# EAGLE design qwiic_blower (EAGLE 9.5.2)
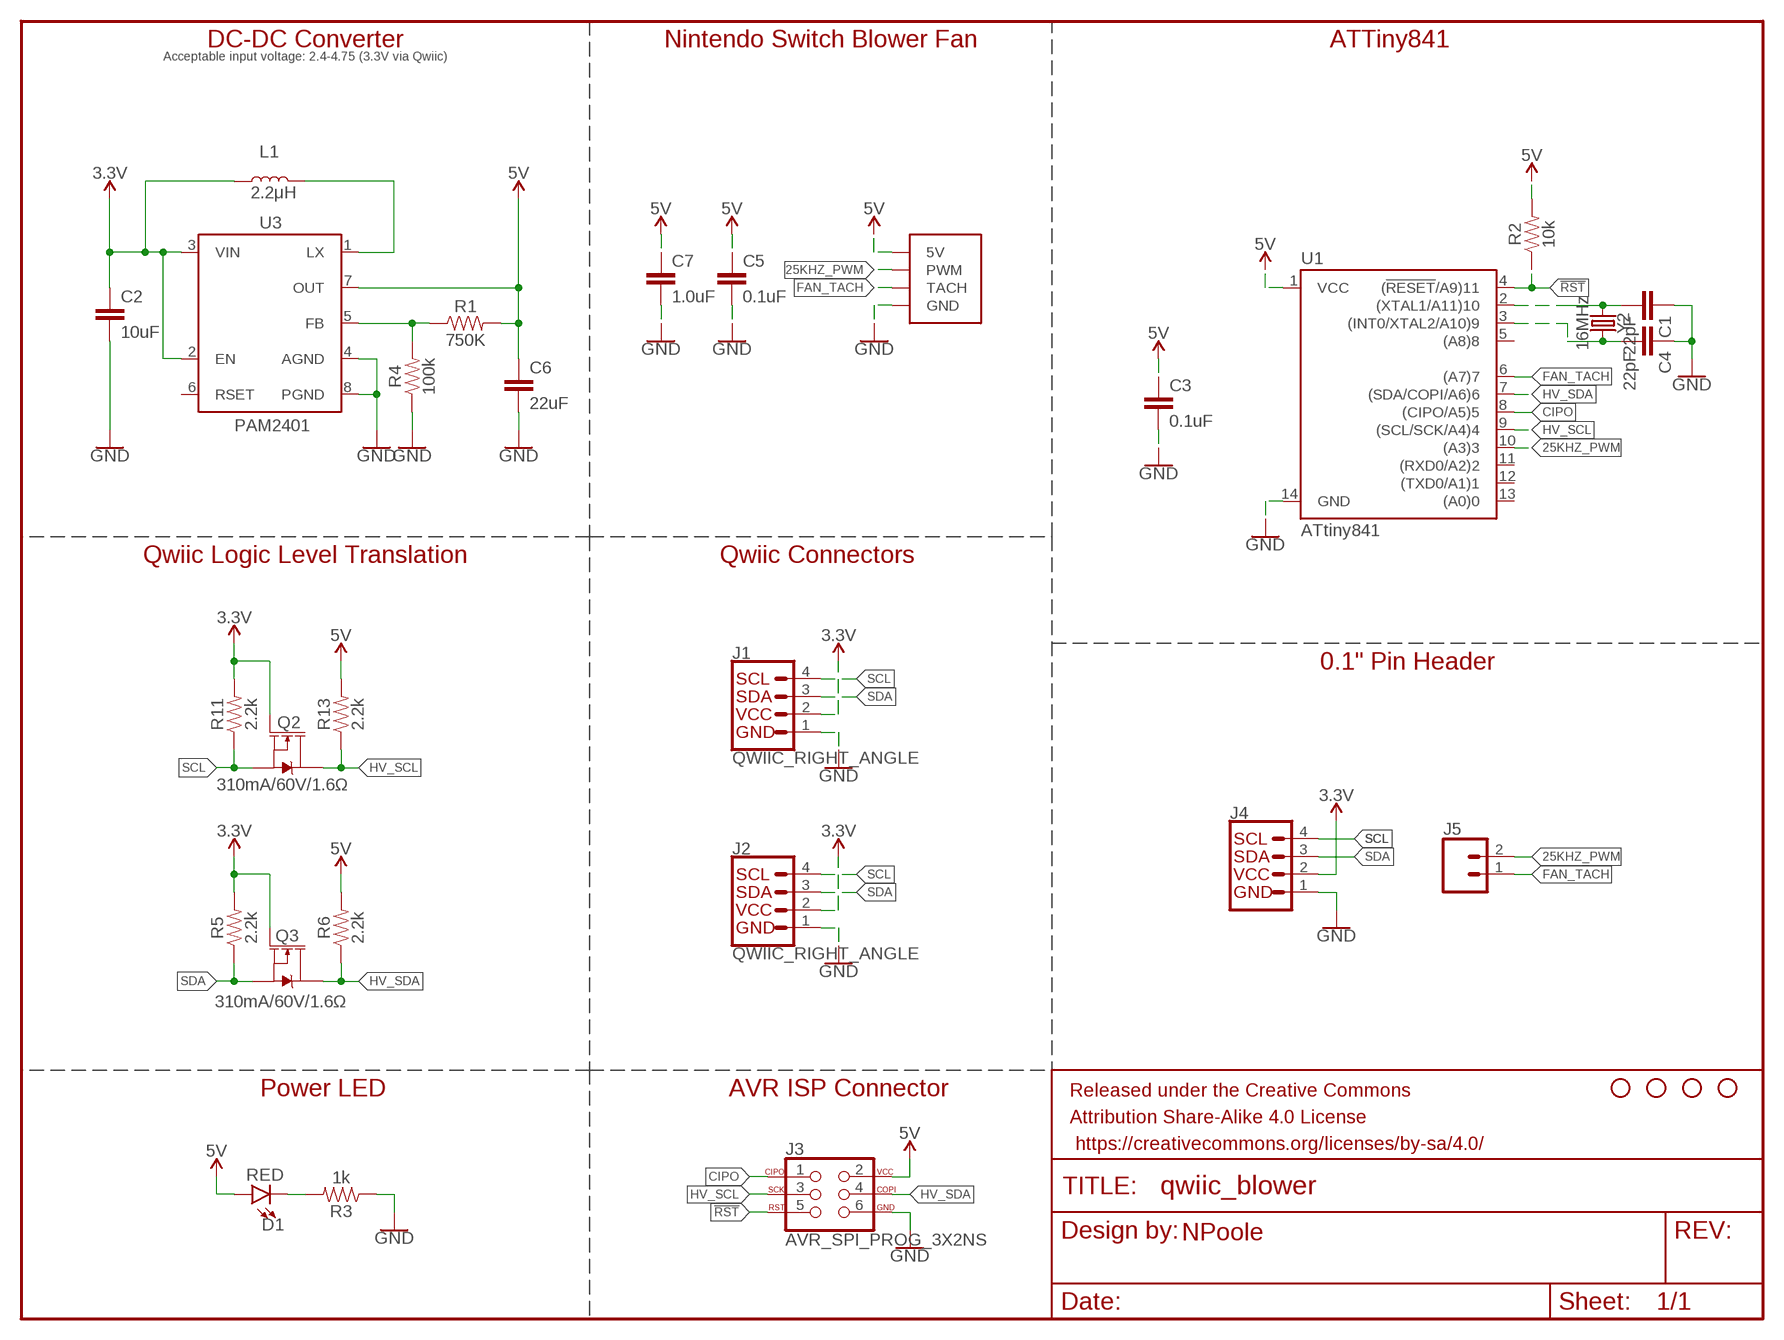
[diagram p0: schematic, sheet 1]

## Parts
C1  22pF  22PF-0603-50V-5%  [0603]
C2  10uF  10UF-0603-6.3V-20%  [0603]
C3  0.1uF  0.1UF-0603-25V-(+80/-20%)  [0603]
C4  22pF  22PF-0603-50V-5%  [0603]
C5  0.1uF  0.1UF-0603-25V-(+80/-20%)  [0603]
C6  22uF  22UF-0805-6.3V-20%  [0805]
C7  1.0uF  1.0UF-0603-16V-10%  [0603]
D1  RED  LED-RED0603  [LED-0603]
FRAME1  FRAME-LETTER  [CREATIVE_COMMONS]
H1  STAND-OFF  [STAND-OFF]
H2  STAND-OFF  [STAND-OFF]
H3  STAND-OFF  [STAND-OFF]
H4  STAND-OFF  [STAND-OFF]
J1  QWIIC_RIGHT_ANGLE  QWIIC_CONNECTORJS-1MM  [JST04_1MM_RA]
J2  QWIIC_RIGHT_ANGLE  QWIIC_CONNECTORJS-1MM  [JST04_1MM_RA]
J3  AVR_SPI_PROG_3X2NS  [2X3-NS]
J4  I2C_STANDARD_NO_SILK  [1X04_NO_SILK]
J5  CONN_021X02_NO_SILK  [1X02_NO_SILK]
L1  2.2μH  2.2μH_SHIELDED_INDUCTOR  [0806]
Q2  310mA/60V/1.6Ω  MOSFET-NCH-2N7002PW  [SOT323]
Q3  310mA/60V/1.6Ω  MOSFET-NCH-2N7002PW  [SOT323]
R1  750K  750KOHM-0603-1/10W-1%  [0603]
R2  10k  10KOHM-0603-1/10W-1%  [0603]
R3  1k  1KOHM-0603-1/10W-1%  [0603]
R4  100k  100KOHM-0603-1/10W-1%  [0603]
R5  2.2k  2.2KOHM-0603-1/10W-1%  [0603]
R6  2.2k  2.2KOHM-0603-1/10W-1%  [0603]
R11  2.2k  2.2KOHM-0603-1/10W-1%  [0603]
R13  2.2k  2.2KOHM-0603-1/10W-1%  [0603]
U1  ATtiny841  ATTINY841-ARDUINO  [SO14]
U3  PAM2401  [MSOP8]
U$19  NINTENDO_SWITCH_FAN  [FPC_4_0.5MM]
Y2  16MHz  CRYSTAL-16MHZSMD-2X1.6  [CRYSTAL-SMD-2.0X1.6MM]

## Nets
3.3V: C2.1 J1.2 J2.2 J4.2 L1.1 Q2.1(G) Q3.1(G) R5.2 R11.2 U3.2(EN) U3.3(VIN)
5V: C3.1 C5.1 C6.1 C7.1 D1.A J3.2 R1.2 R2.2 R6.2 R13.2 U1.1(VCC) U3.7(OUT) U$19.1(5V)
25KHZ_PWM: J5.2 U1.10((A3)3) U$19.4(PWM)
!RST: J3.5 R2.1 U1.4((!RESET!/A9)11)
CIPO: J3.1 U1.8((CIPO/A5)5)
FAN_TACH: J5.1 U1.6((A7)7) U$19.2(TACH)
GND [power]: C1.1 C2.2 C3.2 C4.1 C5.2 C6.2 C7.2 J1.1 J2.1 J3.6 J4.1 R3.1 R4.1 U1.14(GND) U3.4(AGND) U3.8(PGND) U$19.3(GND)
HV_SCL: J3.3 Q2.3(D) R13.1 U1.9((SCL/SCK/A4)4)
HV_SDA: J3.4 Q3.3(D) R6.1 U1.7((SDA/COPI/A6)6)
N$1: C4.2 U1.3((INT0/XTAL2/A10)9) Y2.1
N$2: R1.1 R4.2 U3.5(FB)
N$3: L1.2 U3.1(LX)
N$4: C1.2 U1.2((XTAL1/A11)10) Y2.3
N$5: D1.C R3.2
SCL: J1.4 J2.4 J4.4 Q2.2(S) R11.1
SDA: J1.3 J2.3 J4.3 Q3.2(S) R5.1
Unconnected: U1.5((A8)8) U1.11((RXD0/A2)2) U1.12((TXD0/A1)1) U1.13((A0)0) U3.6(RSET)

## Notes on the sheet
- DC-DC Converter | Nintendo Switch Blower Fan | ATTiny841
- Acceptable input voltage: 2.4-4.75 (3.3V via Qwiic)
- Qwiic Logic Level Translation | Qwiic Connectors
- 0.1" Pin Header
- Power LED | AVR ISP Connector
- NPoole

## Library data of the parts
C1 C4 = SparkFun-Capacitors:22PF: 22pF ceramic capacitors A capacitor is a passive two-terminal electrical component used to store electrical energy temporarily in an electric field.; PROD_ID: CAP-07876
C2 = SparkFun-Capacitors:10UF: 10.0µF ceramic capacitors A capacitor is a passive two-terminal electrical component used to store electrical energy temporarily in an electric field.; PROD_ID: CAP-11015
C3 C5 = SparkFun-Capacitors:0.1UF: 0.1µF ceramic capacitors A capacitor is a passive two-terminal electrical component used to store electrical energy temporarily in an electric field.; PROD_ID: CAP-00810
C6 = SparkFun-Capacitors:22UF: 22µF ceramic capacitors A capacitor is a passive two-terminal electrical component used to store electrical energy temporarily in an electric field.; PROD_ID: CAP-08402
C7 = SparkFun-Capacitors:1.0UF: 1µF ceramic capacitors A capacitor is a passive two-terminal electrical component used to store electrical energy temporarily in an electric field.; PROD_ID: CAP-00868
D1 = SparkFun-LED:LED-RED: Red SMD LED Used in manufacturing of most products at SparkFun Packages: 0603 - SMD 0603 package [Product Link] <http://docs.avagotech.com/docs/AV02-0551EN> 0603 SMART - SMD 0603 SMART package ( more efficient and expensive)[Product Link] <http://www.osram-os.com/Graphics/XPic2/00077099_0.pdf> 1206 - SMD1206 package [Product Link] <https://www.sparkfun.com/datasheets/DevTools/LilyPad/Q150OVS4.pdff> SparkFun Products: Pro Mini 328 -5V <https://www.sparkfun.com/products/821> RedBoard <https://www.sparkfun.com/products/12757> IOIO-OTG <https://www.sparkfun.com/products/13613>; PROD_ID: DIO-00819
FRAME1 = SparkFun-Aesthetics:FRAME-LETTER: Schematic Frame - Letter Standard 8.5x11 US Letter frame
H1-H4 = SparkFun-Hardware:STAND-OFF: Stand Off Drill holes for mechanically mounting via screws, standoffs, etc. Note: Use the keepout ring to avoid running the screw head into surrounding components. Variant Overviews STAND-OFF - Mechanical footprint for a #4 phillips button head screw. STAND-OFF-TIGHT - Mechanical footprint for a #4 phillips button head screw, Example SparkFun Products Screw - Phillips Head (1/4", 4-40, 10 pack) <https://www.sparkfun.com/products/10453> (PRT-10453) Screw - Phillips Head (1/2", 4-40, 10 pack) <https://www.sparkfun.com/products/10452> (PRT-10452) Screw - Phillips Head (3/4", 4-40, 10 pack) <https://www.sparkfun.com/products/10451> (PRT-10451) Screw - Phillips Head (1", 4-40, 10 pack) <https://www.sparkfun.com/products/10450> (PRT-10450)
J1 J2 = SparkFun-Connectors:QWIIC_CONNECTOR: SparkFun I2C Standard Qwiic Connector An SMD 1mm pitch JST connector makes it easy and quick (get it? Qwiic?) to connect I2C devices to each other. The Qwiic system <http://www.sparkfun.com/qwiic> enables fast and solderless connection between popular platforms and various sensors and actuators. We carry 200mm <https://www.sparkfun.com/products/14204>, 100mm <https://www.sparkfun.com/products/14205>, 50mm <https://www.sparkfun.com/products/14206>, and breadboard friendly <https://www.sparkfun.com/products/14207> Qwiic cables. We also offer 10 pcs strips <https://www.sparkfun.com/products/14323> the SMD connectors.; PROD_ID: CONN-13694
J3 = SparkFun-Connectors:AVR_SPI_PROG_3X2: AVR ISP 6 Pin This is the reduced ISP connector for AVR programming. Common on Arduino. This footprint will take up less PCB space and can be used with a 10-pin to 6-pin adapter such as SKU: BOB-08508 **Special note about "TEST_POINT" package. The stop mask is on the top side, so if you want your programming test points to be on the bottom of your board, make sure to place this package on the bottom side of the board. This also ensure that the orientation to program from the bottom side will be correct. SparkFun Products: SparkFun ISP Pogo Adapter <https://www.sparkfun.com/products/11591> - NS Tiny AVR Programmer <https://www.sparkfun.com/products/11801> -PTH
J4 = SparkFun-Connectors:I2C_STANDARD: SparkFun I2C Standard Pinout Header SparkFun has standardized on a pinout for all I2C based sensor breakouts. This pinout allows I2C boards to be plugged directly into the headers on Arduino Uno compatible boards, and to be daisy chained easily. Example SparkFun Products: SparkFun Atmospheric Sensor Breakout - BME280 <https://www.sparkfun.com/products/13676> SparkFun Altitude/Pressure Sensor Breakout - MPL3115A2 <https://www.sparkfun.com/products/11084> SparkFun TOF Range Finder Sensor - VL6180 <https://www.sparkfun.com/products/12785>
J5 = SparkFun-Connectors:CONN_02: Multi connection point. Often used as Generic Header-pin footprint for 0.1 inch spaced/style header connections On any of the 0.1 inch spaced packages, you can populate with these: Break Away Headers - Straight <https://www.sparkfun.com/products/116> (PRT-00116) Break Away Male Headers - Right Angle <https://www.sparkfun.com/products/553> (PRT-00553) Female Headers <https://www.sparkfun.com/products/115> (PRT-00115) Break Away Headers - Machine Pin <https://www.sparkfun.com/products/117> (PRT-00117) Break Away Female Headers - Swiss Machine Pin <https://www.sparkfun.com/products/743> (PRT-00743) For SCREWTERMINALS and SPRING TERMINALS visit here: Screw Terimnals on SparkFun.com <https://www.sparkfun.com/search/results?term=Screw+Terminals> (5mm/3.5mm/2.54mm spacing) This device is also useful as a general connection point to wire up your design to another part of your project. Our various solder wires solder well into these plated through hole pads. Hook-Up Wire - Assortment (Stranded, 22 AWG) <https://www.sparkfun.com/products/11375> (PRT-11375) Hook-Up Wire - Assortment (Solid Core, 22 AWG) <https://www.sparkfun.com/products/11367> (PRT-11367) View the entire wire category on our website here <https://www.sparkfun.com/categories/141> Special notes: Molex polarized connector foot print use with: PRT-08233 with associated crimp pins and housings. 2.54_SCREWTERM for use with PRT-10571. 3.5mm Screw Terminal footprints for PRT-08084 5mm Screw Terminal footprints for use with PRT-08432
L1 = SparkFun-Coils:2.2μH_SHIELDED_INDUCTOR: Murata 2.2uH Inductor 2.2uH 1.2A 110mOhm 0806 Package Shielded; PROD_ID: NDUC-14257
Q2 Q3 = SparkFun-DiscreteSemi:MOSFET-NCH: N-channel MOSFETs Voltage controlled devices that allow control of high current outputs. SparkFun Products: SparkFun OpenScale <https://www.sparkfun.com/products/13261> SparkFun Digital Sandbox <https://www.sparkfun.com/products/12651> SparkFun Monster Moto Shield <https://www.sparkfun.com/products/10182> SparkFun MOSFET Power Controller <https://www.sparkfun.com/products/11214>; PROD_ID: TRANS-11151
R1 = SparkFun-Resistors:750KOHM: 750Ω resistor A resistor is a passive two-terminal electrical component that implements electrical resistance as a circuit element. Resistors act to reduce current flow, and, at the same time, act to lower voltage levels within circuits. - Wikipedia; PROD_ID: RES-13768
R2 = SparkFun-Resistors:10KOHM: 10kΩ resistor A resistor is a passive two-terminal electrical component that implements electrical resistance as a circuit element. Resistors act to reduce current flow, and, at the same time, act to lower voltage levels within circuits. - Wikipedia; PROD_ID: RES-00824
R3 = SparkFun-Resistors:1KOHM: 1kΩ resistor A resistor is a passive two-terminal electrical component that implements electrical resistance as a circuit element. Resistors act to reduce current flow, and, at the same time, act to lower voltage levels within circuits. - Wikipedia; PROD_ID: RES-07856
R4 = SparkFun-Resistors:100KOHM: 100kΩ resistor A resistor is a passive two-terminal electrical component that implements electrical resistance as a circuit element. Resistors act to reduce current flow, and, at the same time, act to lower voltage levels within circuits. - Wikipedia; PROD_ID: RES-07828
R5 R6 R11 R13 = SparkFun-Resistors:2.2KOHM: 2.2kΩ resistor A resistor is a passive two-terminal electrical component that implements electrical resistance as a circuit element. Resistors act to reduce current flow, and, at the same time, act to lower voltage levels within circuits. - Wikipedia; PROD_ID: RES-08272
U1 = SparkFun-IC-Microcontroller:ATTINY841-ARDUINO: ATtiny841; PROD_ID: IC-14692
U3 = SparkFun-IC-Power:PAM2401: PAM2401 - Boost PMIC Specifications: Up to 1A output current 0.9V to 4.75V Input Range 2.5V to 5.0V Adjustable Output Voltage Datasheet <https://www.diodes.com/assets/Datasheets/PAM2401.pdf> (Diodes inc.); PROD_ID: IC-13769
U$19 = SparkFun-Connectors:NINTENDO_SWITCH_FAN
Y2 = SparkFun-Clocks:CRYSTAL-16MHZ: 16MHz Crystal Digikey Example <http://www.digikey.com/product-search/en?keywords=535-9122-1-ND> Frequency: 16MHz Frequency Stability: ±50ppm Frequency Tolerance: ±20ppm Load Capacitance: 18pF SparkFun Products: Pro Micro -5V/16MHz <https://www.sparkfun.com/products/12640> SparkFun Serial Enabled LCD Kit <https://www.sparkfun.com/products/10097>; PROD_ID: XTAL-14681

## Net classes
1 power: width 0.203 mm

## Board
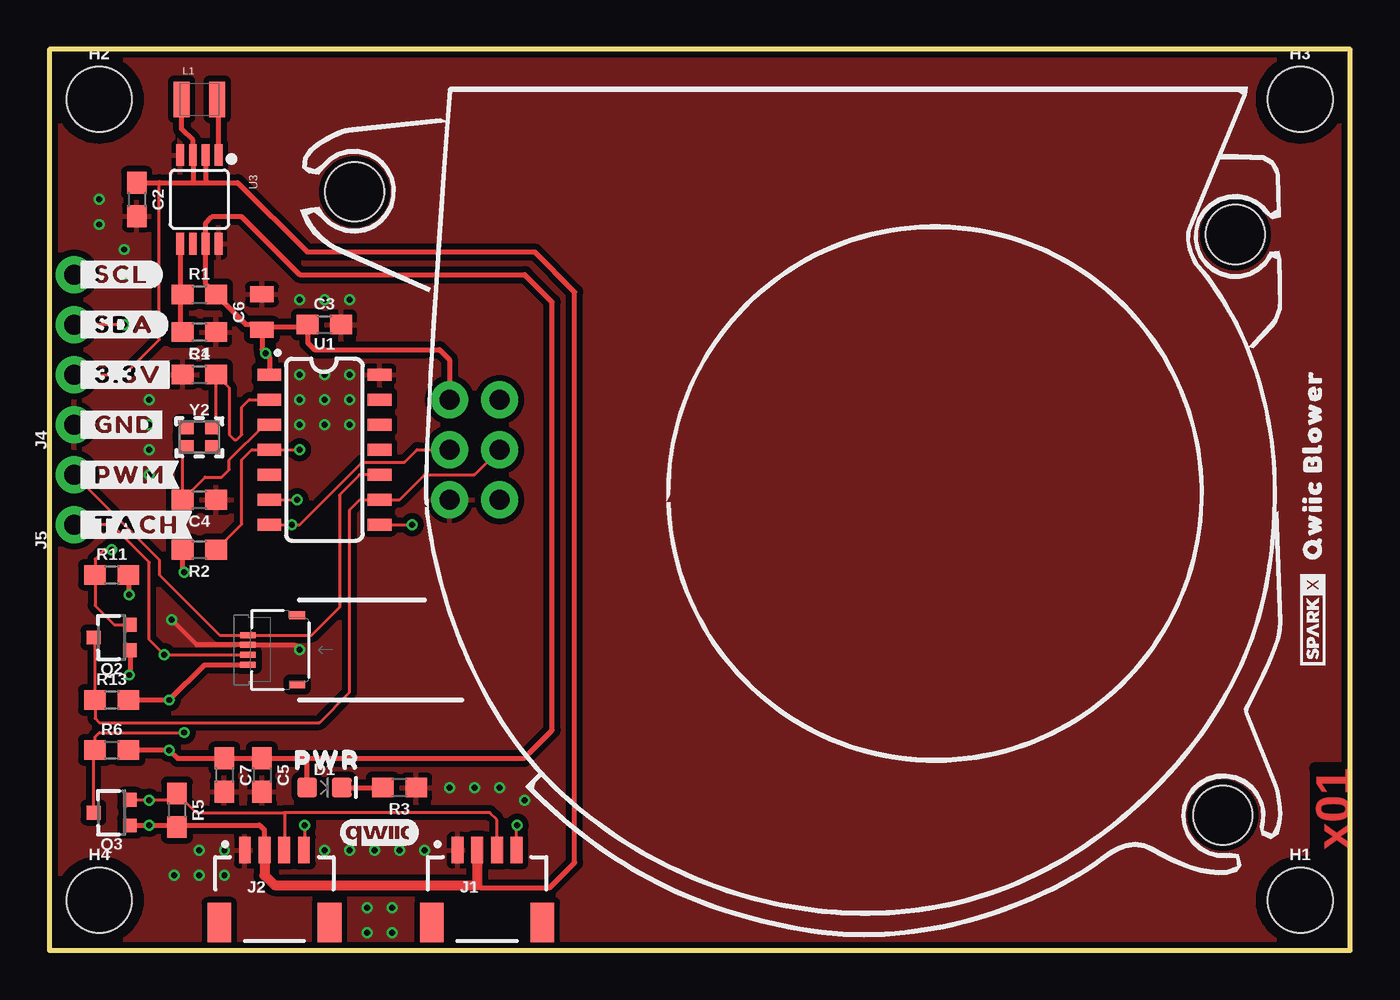
[diagram p1: board, top side]
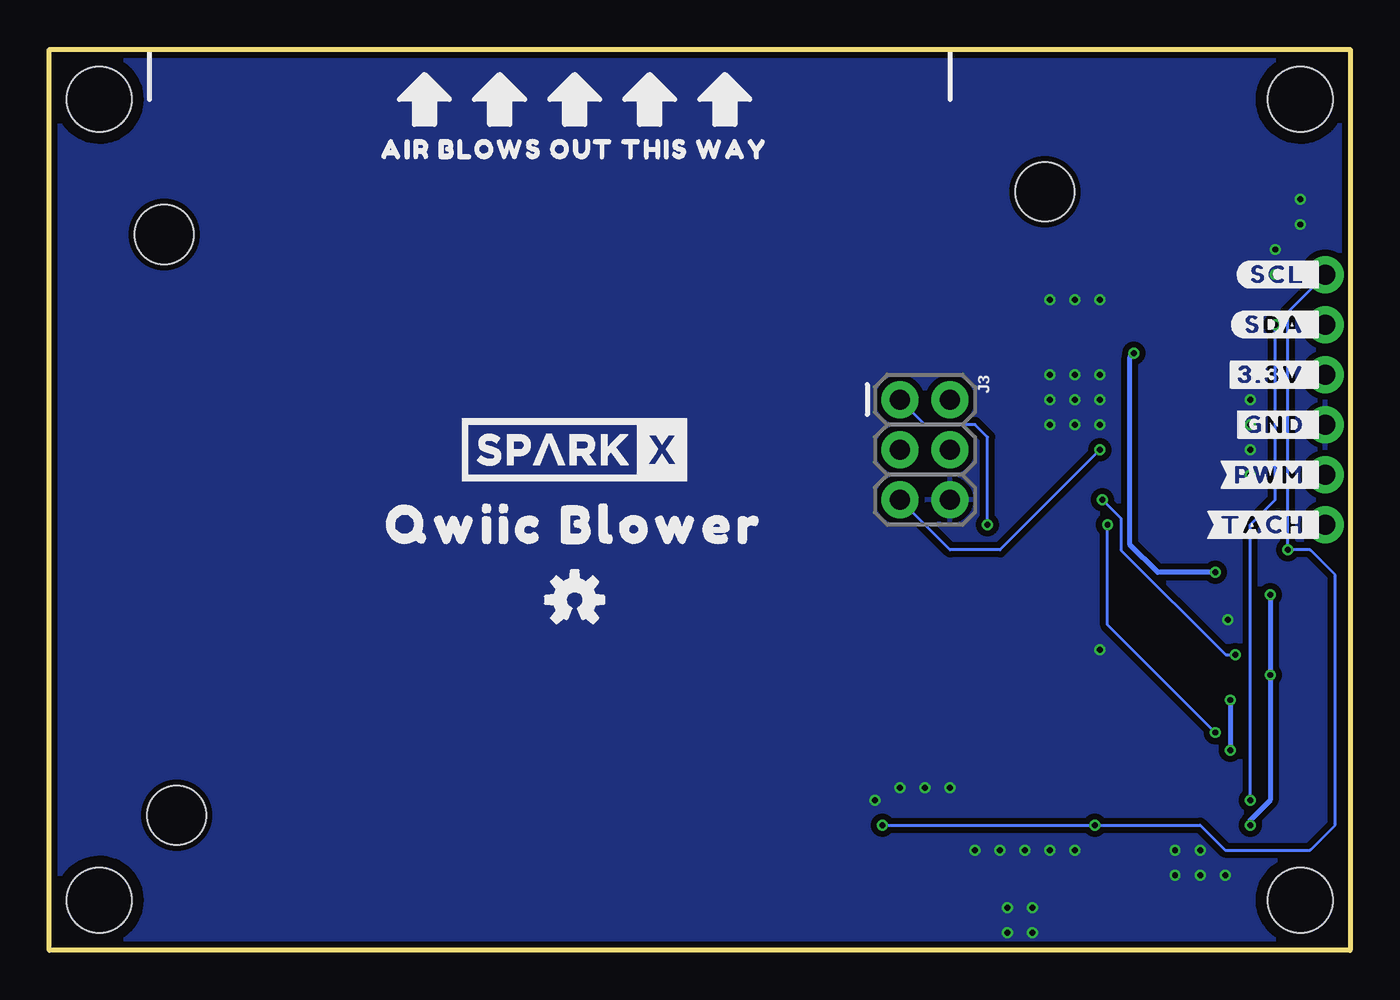
[diagram p2: board, bottom side, seen from below]

Size 66.04 x 45.72 mm. Coordinates in mm from the lower left corner, seen from the top.
Outline: 0,0 66.04,0 66.04,45.72 0,45.72 0,0
Copper layers (1*16): Top 0.035mm / dielectric 1.5mm / Bottom 0.035mm
Design rules "SparkFun-2-Layer-Minimum-JLCPCB": minimum track width 5mil, minimum drill 0.3mm, track to track 5mil, track to pad 5mil, pad to pad 5mil, via to via 5mil, smd to smd 5mil, copper to edge 7mil, drill to drill 7mil, minimum pad ring 5mil, minimum via ring 5mil, stop-mask expansion 4mil, vias tented up to drill 25mil, thermal gap 10mil

### Footprints (pad centres in the part's own frame; a part is rotated, then mirrored left to right if it is on the bottom)
0603 = smd 1.1 x 1: 1 -0.85,0; 2 0.85,0
0805 = smd 0.8 x 1.2: 1 -0.9,0; 2 0.9,0
LED-0603 = smd 1 x 1: A -0.877,0; C 0.877,0
STAND-OFF = hole 3.302: 0,0
JST04_1MM_RA = smd 0.6 x 1.35: 1 -1.5,0; 2 -0.5,0; 3 0.5,0; 4 1.5,0 | smd 1.2 x 2: NC1 2.8,-3.675; NC2 -2.8,-3.675
2X3-NS = drill 1.016 pad 1.88: 1 -2.54,-1.27; 2 -2.54,1.27; 3 0,-1.27; 4 0,1.27; 5 2.54,-1.27; 6 2.54,1.27
1X04_NO_SILK = drill 1.016 pad 1.88: 1 0,0; 2 2.54,0; 3 5.08,0; 4 7.62,0
1X02_NO_SILK = drill 1.016 pad 1.88: 1 0,0; 2 2.54,0
0806 = smd 0.8 x 1.8: 1 -0.9,0; 2 0.9,0
SOT323 = smd 0.7 x 0.7: 1 -0.65,-0.925; 2 0.65,-0.925; 3 0,0.925
SO14 = smd 0.6 x 1.2: 1 -3.81,-2.8; 2 -2.54,-2.8; 3 -1.27,-2.8; 4 0,-2.8; 5 1.27,-2.8; 6 2.54,-2.8; 7 3.81,-2.8; 8 3.81,2.8; 9 2.54,2.8; 10 1.27,2.8; 11 0,2.8; 12 -1.27,2.8; 13 -2.54,2.8; 14 -3.81,2.8
MSOP8 = smd 0.4 x 1.1: 1 -0.975,-2.25; 2 -0.325,-2.25; 3 0.325,-2.25; 4 0.975,-2.25; 5 0.975,2.25; 6 0.325,2.25; 7 -0.325,2.25; 8 -0.975,2.25
FPC_4_0.5MM = smd 0.3 x 0.8: 1 -0.754,1.35; 2 -0.254,1.35; 3 0.254,1.35; 4 0.754,1.35 | smd 0.4 x 0.8: MP1 -1.754,-1.15; MP2 1.754,-1.15 | hole 3: 23.241,-4.064; 21.082,-48.768; -8.382,-48.133
CRYSTAL-SMD-2.0X1.6MM = smd 0.75 x 0.7: 1 -0.675,-0.5; 2 0.675,-0.5; 3 0.675,0.5; 4 -0.675,0.5

### Placement (x,y rotation side)
C1  7.62,29.21 0 top
C2  4.45,38.1 270 top
C3  13.97,31.75 0 top
C4  7.62,22.86 180 top
C5  10.79,8.89 270 top
C6  10.79,32.38 90 top
C7  8.89,8.89 270 top
D1  13.97,8.26 0 top
FRAME1  12.7,-8.89 0 top  (outside the outline)
H1  63.5,2.54 0 top
H2  2.54,43.18 0 top
H3  63.5,43.18 0 top
H4  2.54,2.54 0 top
J1  22.23,5.08 0 top
J2  11.43,5.08 0 top
J3  21.59,25.4 270 bottom
J4  1.27,26.67 90 top
J5  1.27,21.59 90 top
L1  7.62,43.18 0 top
Q2  3.17,15.88 90 top
Q3  3.17,6.99 90 top
R1  7.62,33.27 0 top
R2  7.62,20.32 180 top
R3  17.78,8.26 180 top
R4  7.62,31.37 180 top
R5  6.48,7.11 270 top
R6  3.17,10.16 0 top
R11  3.17,19.05 0 top
R13  3.17,12.7 0 top
U1  13.97,25.4 270 top
U3  7.62,38.1 180 top
U$1  [#_TACH#0]  1.27,21.59 0 top
U$2  [#_PWM#0]  1.27,24.13 0 top
U$3  [#_GND#0]  1.27,26.67 0 top
U$4  [#_3#3V#0]  1.27,29.21 0 top
U$5  [#_SDA#0]  1.27,31.75 0 top
U$6  [#_SCL#0]  1.27,34.29 0 top
U$7  [#SCL_#0]  1.27,34.29 0 bottom
U$8  [#SDA_#0]  1.27,31.75 0 bottom
U$9  [#3#3V_#0]  1.27,29.21 0 bottom
U$10  [#GND_#0]  1.27,26.67 0 bottom
U$11  [#PWM_#0]  1.27,24.13 0 bottom
U$12  [#TACH_#0]  1.27,21.59 0 bottom
U$13  [QWIIC_4MM]  16.76,5.97 0 top
U$14  [QWIIC_BLOWER0]  64.14,24.64 90 top
U$15  [SPARKX-TINY]  64.14,16.76 90 top
U$16  [AIR_BLOWS_OUT_THIS_WAY0]  39.37,40.64 0 bottom
U$17  [_QWIIC_BLOWER_0]  39.37,21.59 0 bottom
U$18  [SPARKX-LARGE]  39.37,25.4 0 bottom
U$19  11.43,15.24 90 top
U$20  [OSHW-LOGO-S]  39.37,17.78 0 bottom
U$21  [PWR0]  14.1,9.65 0 top
Y2  7.62,26.04 0 top

### Tracks (layer width: path | path; a pad name or v marks a point on that pad's centre or on a via)
3.3V  (via drill 0.3)
  Top 0.152: J4.2 3.81,29.21 5.59,30.99 5.59,38.95
  Top 0.254: L1.1 6.72,41.67 7.29,41.09 U3.3 7.29,39.02 7.37,38.95 | 21.73,3.31 21.86,3.17 25.4,3.17 26.67,4.45 26.67,33.4 24.64,35.43 13.08,35.43 9.56,38.95 8.04,38.95 | J2.2 10.93,6.09 10.67,6.35 6.57,6.35 R5.2 6.4,6.33 v5.08,6.33 Q3.1 | C2.1 5.59,38.95 7.37,38.95 | 7.37,38.95 8.04,38.95 | U3.2 7.95,39.05 8.04,38.95 | Q2.1 4.1,14.01 v4.06,13.97 | R11.2 4.03,18.07 v4.06,18.03
  Top 0.508: J2.2 10.93,3.8 11.43,3.3 21.72,3.3 21.73,3.31 J1.2
  Bottom 0.254: v5.08,6.33 5.08,6.6 4.06,7.62 v4.06,13.97 v4.06,18.03
5V  (via drill 0.3)
  Top 0.254: C6.1 10.79,30.48 v10.99,30.29 11.18,30.1 U1.1 | C6.1 10.93,31.62 12.99,31.62 | C3.1 13.12,30.82 13.46,30.48 19.81,30.48 20.32,29.97 J3.2 | v6.86,19.18 6.77,19.27 R2.2 | R6.2 v6.1,10.16 6.52,9.74 C7.1 C5.1 13.08,9.74 | R13.2 v6.1,12.7 7.88,14.49 U$19.1 | 13.08,9.74 24.09,9.74 25.53,11.18 25.53,32.89 24.13,34.29 12.7,34.29 9.78,37.21 8.26,37.21 7.95,36.9 U3.7 7.95,33.8 R1.2 9.99,31.75 10.29,31.75 10.55,31.48 C6.1 | D1.A 13.09,9.73 13.08,9.74
  Top 0.508: 12.99,31.62 C3.1
  Bottom 0.254: v10.99,30.29 11.18,30.1 11.18,20.57 9.78,19.18 v6.86,19.18 | v6.1,12.7 v6.1,10.16
25KHZ_PWM
  Top 0.152: J5.2 5.59,19.81 5.59,19.05 8.64,15.99 U$19.4 13.32,15.99 14.73,17.4 14.73,23.11 15.75,24.13 U1.10
!RST  (via drill 0.3)
  Top 0.152: R2.1 9.78,21.63 9.78,24.89 10.29,25.4 U1.4 v12.7,25.4
  Bottom 0.152: v12.7,25.4 17.78,20.32 20.32,20.32 J3.5
CIPO  (via drill 0.3)
  Top 0.152: U1.8 v18.41,21.59
  Bottom 0.152: v18.41,21.59 18.41,26.04 19.05,26.67 21.59,26.67 J3.1
FAN_TACH  (via drill 0.3)
  Top 0.152: J5.1 3.17,21.59 5.08,19.68 5.08,15.75 v5.84,14.99 U$19.2 | U1.6 v12.57,22.86
  Bottom 0.152: v12.57,22.86 11.63,21.92 11.63,20.31 6.31,14.99 v5.84,14.99
GND  (via drill 0.3)
  Top 0.203: 7.49,15.49 v6.22,16.76
  Top 0.254: 7.49,15.49 U$19.3 12.45,15.49 v12.7,15.24
  other vias: 13.97,5.08 15.24,5.08 16.51,5.08 17.78,5.08 19.05,5.08 2.54,38.1 2.54,36.83 3.81,35.56 3.81,34.29 12.7,33.02 13.97,33.02 15.24,33.02 5.08,27.94 5.08,26.67 5.08,25.4 5.08,24.13 12.7,29.21 12.7,27.94 12.7,26.67 13.97,26.67 15.24,26.67 15.24,27.94 13.97,27.94 13.97,29.21 15.24,29.21 7.62,5.08 8.89,5.08 8.89,3.81 7.62,3.81 6.35,3.81 20.32,8.26 21.59,8.26 22.86,8.26 24.13,7.62 16.13,0.89 17.4,0.89 16.13,2.16 17.4,2.16
  pour Top (isolate 0.305): 0,45.72 66.04,45.72 66.04,0 0,0
  pour Bottom (isolate 0.305): 0,45.72 0,0 66.04,0 66.04,45.72
HV_SCL
  Top 0.152: Q2.3 2.33,15.8 R13.1 2.33,11.77 2.54,11.56 13.72,11.56 15.24,13.08 15.24,22.35 15.75,22.86 U1.9 17.78,22.86 19.05,24.13 21.59,24.13 J3.3
HV_SDA  (via drill 0.3)
  Top 0.152: Q3.3 2.25,10.09 R6.1 2.33,10.83 2.54,11.05 v6.86,11.05 | U1.7 v12.32,21.59 12.7,21.59 15.88,24.77 18.03,24.77 18.67,25.4 J3.4
  Bottom 0.152: v6.86,11.05 12.32,16.51 v12.32,21.59
N$1
  Top 0.152: Y2.1 6.77,25.36 C4.2 7.91,24 8.76,24 9.14,24.38 9.14,24.89 10.92,26.67 U1.3
N$2
  Top 0.254: U3.5 6.64,33.4 | 6.64,33.15 6.64,31.5
  Top 0.508: 6.64,33.4 R1.1 6.64,33.15 | 6.64,31.5 R4.2
N$3
  Top 0.254: U3.1 8.6,43.1 L1.2
N$4
  Top 0.152: Y2.3 8.47,26.71 C1.2 9.14,28.54 9.14,26.16 9.4,25.91 9.53,25.91 9.78,26.16 9.78,27.56 10.16,27.94 U1.2
N$5
  Top 0.254: D1.C R3.2
SCL  (via drill 0.3)
  Top 0.152: v12.95,6.35 12.95,5.1 J2.4 | J1.4 23.73,6.33 v23.75,6.35 | Q2.2 4.08,16.51 3.3,16.51 2.33,17.49 R11.1 2.33,19.85 2.79,20.32 v3.17,20.32
  Bottom 0.152: v23.75,6.35 v12.95,6.35 7.62,6.35 6.35,5.08 2.03,5.08 0.76,6.35 0.76,19.05 2.03,20.32 v3.17,20.32 3.17,32.38 J4.4
SDA  (via drill 0.3)
  Top 0.152: Q3.2 4.12,7.62 v5.08,7.62 6.13,7.62 R5.1 7.45,6.99 11.94,6.99 | 11.94,6.99 J2.3 | J1.3 22.73,6.61 22.35,6.99 11.94,6.99 | v3.81,31.75 J4.3
  Bottom 0.152: v5.08,7.62 5.08,21.59 3.81,22.86 v3.81,31.75

### Text on the board
Top: x01
tDocu: NPoole